# EAGLE schematic omni (EAGLE 9.6.2)
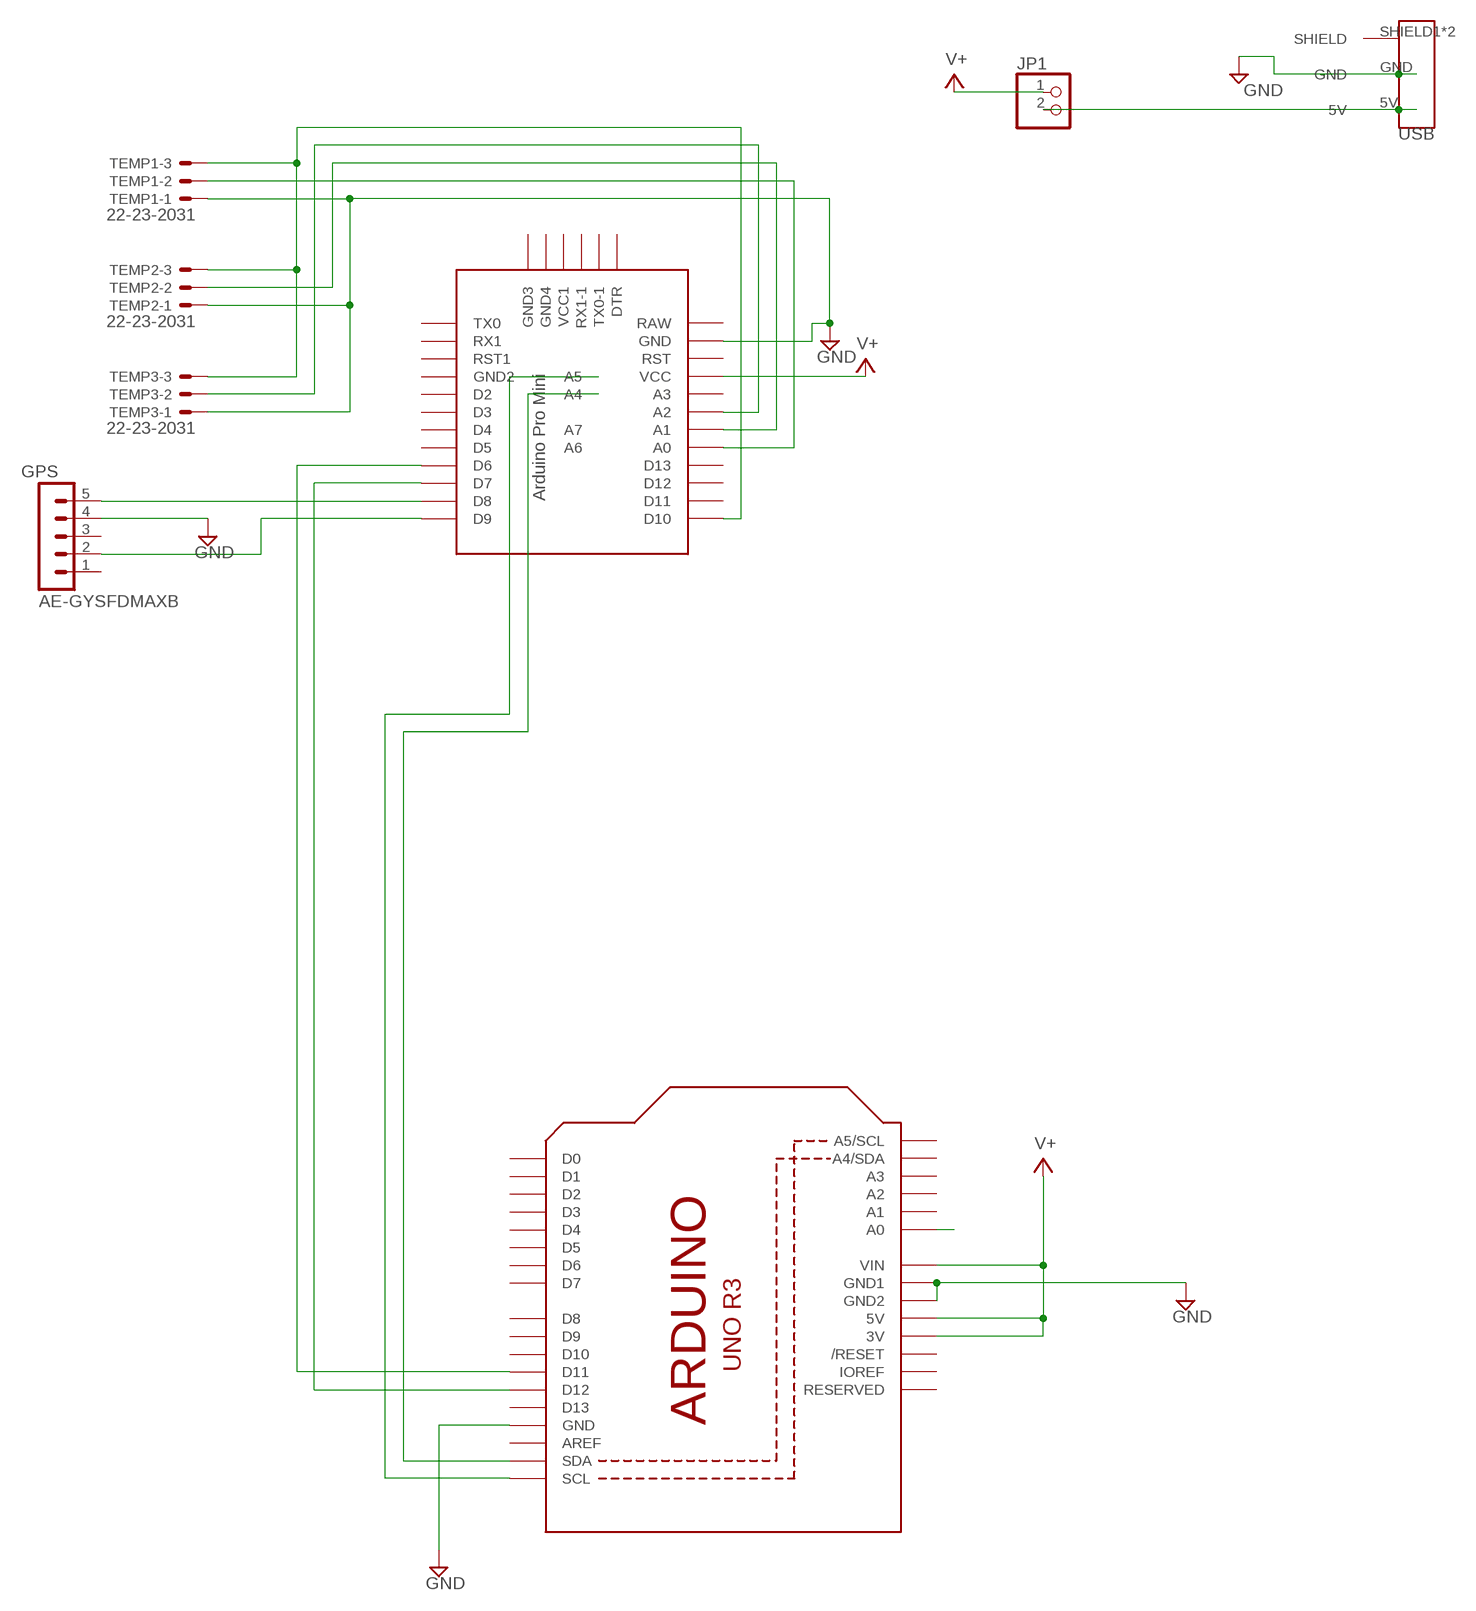
[diagram p0: schematic, sheet 1]

## Parts
GPS  AE-GYSFDMAXB  GPSAKITSUKI  [MA05-1]
JP1  PINHD-1X2  [1X02]
LTE_LORA  ARDUINOR3-BPLACE  [ARDUINOR3-BPLACE]
TEMP1  22-23-2031  [22-23-2031]
TEMP2  22-23-2031  [22-23-2031]
TEMP3  22-23-2031  [22-23-2031]
U$1  PRO-MINI-2  [PRO-MINI-2]
USB  MICROUSBCON  [MICROUSBCON]

## Nets
GND: GPS.4(GND) LTE_LORA.GND LTE_LORA.GND1 LTE_LORA.GND2 TEMP1.1 TEMP2.1 TEMP3.1 U$1.GND USB.GND
N$1: GPS.2 U$1.D9
N$2: GPS.5(5V) U$1.D8
N$3: TEMP1.2 U$1.A0
N$4: LTE_LORA.3V LTE_LORA.5V LTE_LORA.VIN ; supply symbol labelled V+
N$6: TEMP2.2 U$1.A1
N$8: TEMP3.2 U$1.A2
N$9: TEMP1.3 TEMP2.3 TEMP3.3 U$1.D10
N$12: JP1.2 USB.5V
N$13: LTE_LORA.SDA U$1.A4
N$14: LTE_LORA.SCL U$1.A5
N$15: LTE_LORA.D12 U$1.D7
N$16: LTE_LORA.D11 U$1.D6
N$19: LTE_LORA.A0
V+: JP1.1 U$1.VCC
Unconnected: GPS.1 GPS.3 LTE_LORA.A1 LTE_LORA.A2 LTE_LORA.A3 LTE_LORA.A4(A4/SDA) LTE_LORA.A5(A5/SCL) LTE_LORA.AREF LTE_LORA.D0 LTE_LORA.D1 LTE_LORA.D2 LTE_LORA.D3 LTE_LORA.D4 LTE_LORA.D5 LTE_LORA.D6 LTE_LORA.D7 LTE_LORA.D8 LTE_LORA.D9 LTE_LORA.D10 LTE_LORA.D13 LTE_LORA.IOREF LTE_LORA.RESERVED LTE_LORA.RESET(/RESET) U$1.A3 U$1.A6 U$1.A7 U$1.D2 U$1.D3 U$1.D4 U$1.D5 U$1.D11 U$1.D12 U$1.D13 U$1.DTR U$1.GND1(GND2) U$1.GND2(GND3) U$1.GND3(GND4) U$1.RAW U$1.RST U$1.RST1 U$1.RX1 U$1.RX1-1 U$1.TX0 U$1.TX0-1 U$1.VCC1 USB.SHIELD1(SHIELD) USB.SHIELD2(SHIELD)

## Library data of the parts
GPS = OMNI:GPSAKITSUKI: GPS MODULE; OC_FARNELL: unknown; OC_NEWARK: unknown
JP1 = pinhead:PINHD-1X2: PIN HEADER
LTE_LORA = adafruit:ARDUINOR3: This is a new object for the new Arduino R3 - with extra pins that you may want to use (such as IOref, and duplicated A4/A5
TEMP1-TEMP3 = con-molex:22-23-2031: .100" (2.54mm) Center Header - 3 Pin; MF: MOLEX; MPN: 22-23-2031; OC_FARNELL: 1462950; OC_NEWARK: 30C0862
U$1 = Arduino-clone:PRO-MINI-2: Arduino Pro Mini Layout 2 Sparkfun.com
USB = OMNI:MICROUSBCON